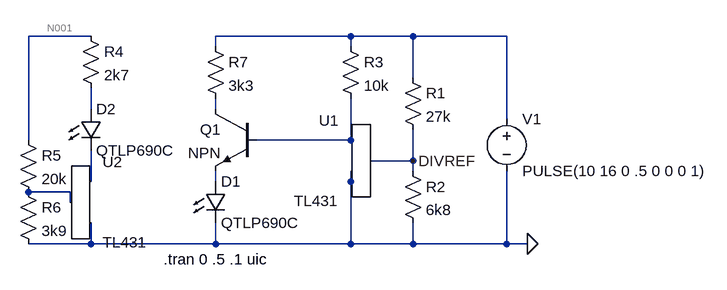
[diagram p0: schematic two_level.asc]
two_level.asc, the LTspice schematic file:
Version 4
SHEET 1 880 680
WIRE -240 -64 -336 -64
WIRE 160 -64 -48 -64
WIRE 256 -64 160 -64
WIRE 400 -64 256 -64
WIRE -48 -48 -48 -64
WIRE 160 -48 160 -64
WIRE 256 0 256 -64
WIRE -240 48 -240 16
WIRE -48 48 -48 32
WIRE 400 64 400 -64
WIRE -336 96 -336 -64
WIRE 160 96 160 32
WIRE 160 96 16 96
WIRE 256 128 256 80
WIRE 256 128 192 128
WIRE 256 144 256 128
WIRE -240 160 -240 112
WIRE -48 160 -48 144
WIRE 160 160 160 144
WIRE -272 176 -336 176
WIRE -272 192 -272 176
WIRE -240 256 -240 224
WIRE -240 256 -336 256
WIRE -48 256 -48 224
WIRE -48 256 -240 256
WIRE 160 256 160 160
WIRE 160 256 -48 256
WIRE 256 256 256 224
WIRE 256 256 160 256
WIRE 400 256 400 144
WIRE 400 256 256 256
WIRE 432 256 400 256
FLAG 432 256 0
FLAG 256 128 DIVREF
SYMBOL ZZZ\\REF\\TL431 176 96 M0
SYMATTR InstName U1
SYMBOL LED -64 160 R0
SYMATTR InstName D1
SYMATTR Value QTLP690C
SYMBOL res 240 -16 R0
SYMATTR InstName R1
SYMATTR Value 27k
SYMBOL res 240 128 R0
SYMATTR InstName R2
SYMATTR Value 6k8
SYMBOL res 144 -64 R0
SYMATTR InstName R3
SYMATTR Value 10k
SYMBOL voltage 400 48 R0
WINDOW 123 0 0 Left 0
WINDOW 39 0 0 Left 0
SYMATTR InstName V1
SYMATTR Value PULSE(10 16 0 .5 0 0 0 1)
SYMBOL ZZZ\\REF\\TL431 -256 160 R0
SYMATTR InstName U2
SYMBOL LED -256 48 R0
SYMATTR InstName D2
SYMATTR Value QTLP690C
SYMBOL res -256 -80 R0
SYMATTR InstName R4
SYMATTR Value 2k7
SYMBOL res -352 80 R0
SYMATTR InstName R5
SYMATTR Value 20k
SYMBOL res -352 160 R0
SYMATTR InstName R6
SYMATTR Value 3k9
SYMBOL npn 16 48 M0
SYMATTR InstName Q1
SYMBOL res -64 -64 R0
SYMATTR InstName R7
SYMATTR Value 3k3
TEXT -128 280 Left 2 !.tran 0 .5 .1 uic

The netlist it stands for:
* two_level.asc
XU1 DIVREF 0 N005 TL431
D1 N007 0 QTLP690C
R1 N002 DIVREF 27k
R2 DIVREF 0 6k8
R3 N002 N005 10k
V1 N002 0 PULSE(10 16 0 .5 0 0 0 1)
XU2 N008 0 N006 TL431
D2 N003 N006 QTLP690C
R4 N001 N003 2k7
R5 N001 N008 20k
R6 N008 0 3k9
Q1 N004 N005 N007 0 NPN
R7 N002 N004 3k3
.model D D
.lib standard.dio
.model NPN NPN
.model PNP PNP
.lib standard.bjt
.tran 0 .5 .1 uic
.lib TL431.mod
.backanno
.end

* Results of the author's LTspice run, read from the files saved beside the schematic
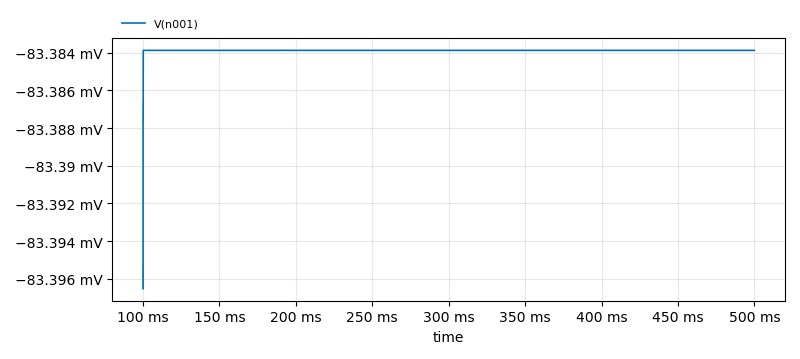
[diagram p1: Transient Analysis of two_level.asc, plotted from the saved traces]
* Transient Analysis, 1 run:
*   V(n001): min -83.4 mV, max -83.38 mV, average -83.38 mV, rms 83.38 mV, last -83.38 mV